# Altium project 定位.PrjPCB
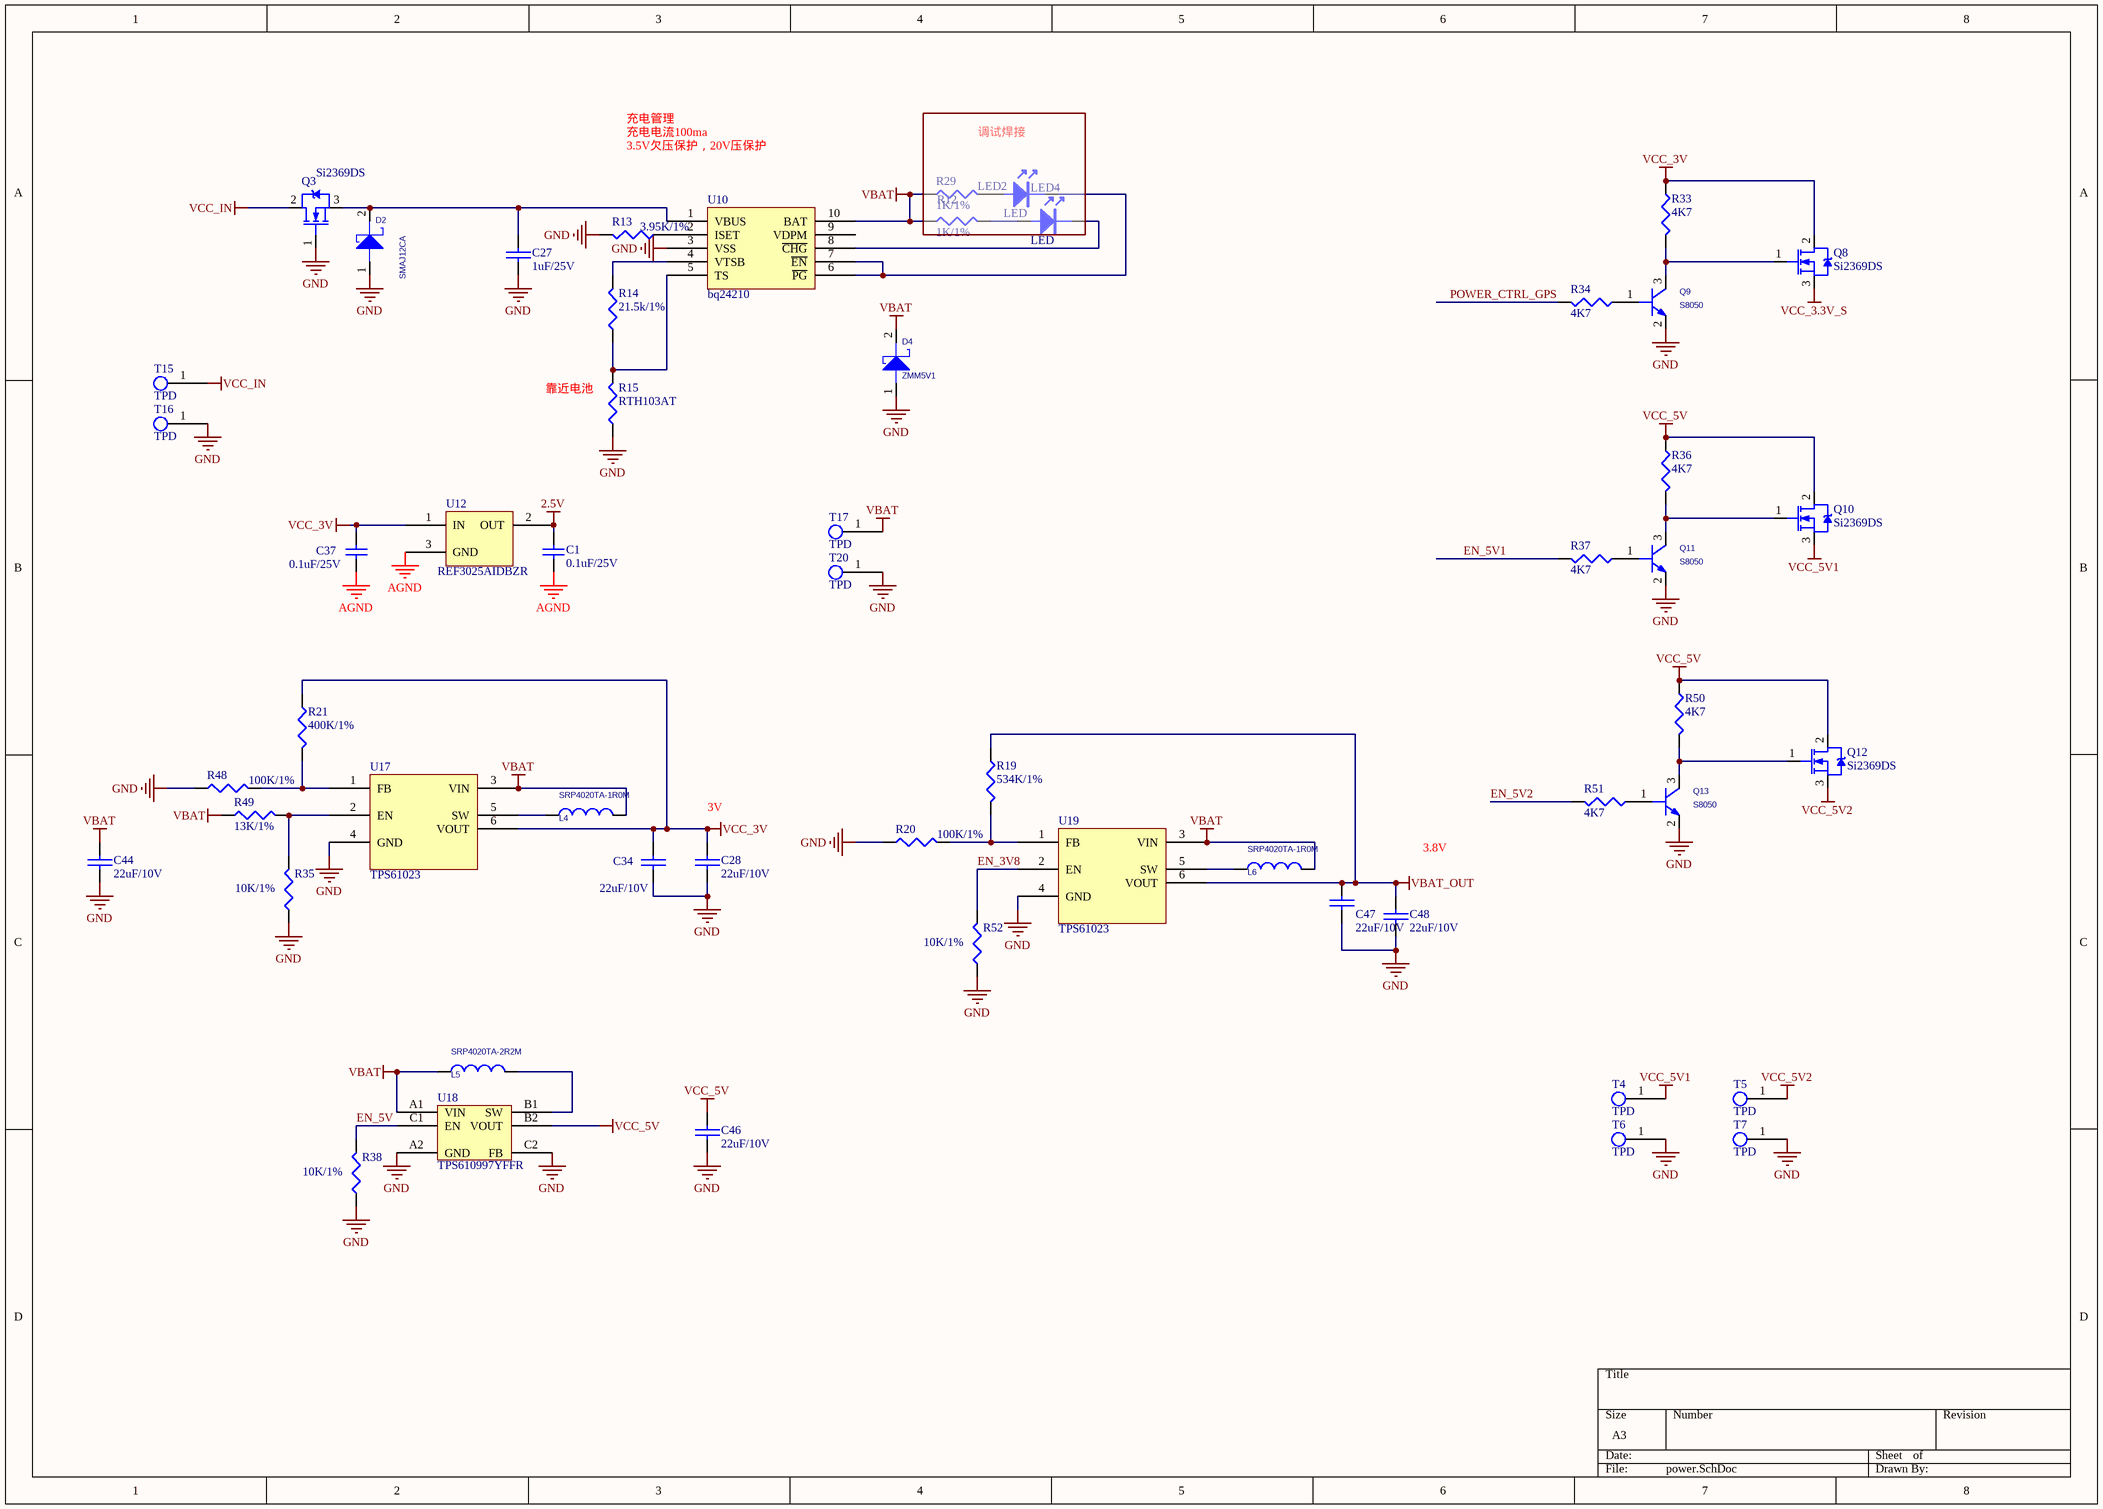
[diagram p0: power.SchDoc]
2 sheets, 100 parts. Net scope: global (net labels, ports and power ports of the same name join across sheets).
Board file: PCB1.2.PcbDoc
Sheets:
  power.SchDoc
  GPS&&lte.SchDoc

## Sheet power.SchDoc
size A3

### Parts
C1  0.1uF/25V  [0402c]
C27  1uF/25V  [0402C]
C28  22uF/10V  [0805C]
C34  22uF/10V  [0805C]
C37  0.1uF/25V  [0402c]
C44  22uF/10V  [0805C]
C46  22uF/10V  [0805C]
C47  22uF/10V  [0805C]
C48  22uF/10V  [0805C]
D2  SMAJ12CA  [SMA]
D4  value ZMM5V1  [LL-34(D1206)]  (hidden comment: DIODE_SCHOTTKY_0)
L4  SRP4020TA-1R0M  [L2520]
L5  SRP4020TA-2R2M  [L2520]
L6  SRP4020TA-1R0M  [L2520]
LED2  LED  [0603LED]
LED4  LED  [0603LED]
Q3  Si2369DS  [sot23-3]
Q8  Si2369DS  [sot23-3]
Q9  S8050  [SOT23-3]
Q10  Si2369DS  [sot23-3]
Q11  S8050  [SOT23-3]
Q12  Si2369DS  [sot23-3]
Q13  S8050  [SOT23-3]
R12  1K/1%  [0402R]
R13  3.95K/1%  [0402R]
R14  21.5k/1%  [0402R]
R15  RTH103AT  [0603R]
R19  534K/1%  [0402R]
R20  100K/1%  [0402R]
R21  400K/1%  [0402R]
R29  1K/1%  [0402R]
R33  4K7  [0402R]
R34  4K7  [0402R]
R35  10K/1%  [0402R]
R36  4K7  [0402R]
R37  4K7  [0402R]
R38  10K/1%  [0402R]
R48  100K/1%  [0402R]
R49  13K/1%  [0402R]
R50  4K7  [0402R]
R51  4K7  [0402R]
R52  10K/1%  [0402R]
T4  TPD  [TP]
T5  TPD  [TP]
T6  TPD  [TP]
T7  TPD  [TP]
T15  TPD  [TP]
T16  TPD  [TP]
T17  TPD  [TP]
T20  TPD  [TP]
U10  bq24210  [QFN50P200X300X80-10N]
U12  REF3025AIDBZR  [SOT23-3]
U17  TPS61023  [SOT563-6]
U18  TPS610997YFFR  [TPS610997YFFR]
U19  TPS61023  [SOT563-6]

### Blocks framed on the sheet
调试焊接: LED2 LED4 R12 R29

### Nets
2.5V: C1.1 U12.2(OUT)
AGND: C1.2 C37.2 U12.3(GND)
GND: C27.2 C28.2 C34.2 C44.2 C46.2 C47.2 C48.2 D2.1 D4.1 Q3.1(G) Q9.2(E) Q11.2(E) Q13.2(E) R13.2 R15.1 R20.1 R35.1 R38.1 R48.1 R52.1 T6.1 T7.1 T16.1 T20.1 U10.3(VSS) U17.4(GND) U18.A2(GND) U18.C2(FB) U19.4(GND)
VBAT: C44.1 D4.2 L4.2 L5.1 L6.2 R12.1 R29.1 R49.1 T17.1 U10.10(BAT) U17.3(VIN) U18.A1(VIN) U19.3(VIN)
VBAT_OUT: C47.1 C48.1 R19.1 U19.6(VOUT)
VCC_3.3V_S: Q8.3(S)
VCC_3V: C28.1 C34.1 C37.1 Q8.2(D) R21.1 R33.1 U12.1(IN) U17.6(VOUT)
VCC_5V: C46.1 Q10.2(D) Q12.2(D) R36.1 R50.1 U18.B2(VOUT)
VCC_5V1: Q10.3(S) T4.1
VCC_5V2: Q12.3(S) T5.1
VCC_IN: Q3.2(D) T15.1
EN_3V8: R52.2 U19.2(EN)
EN_5V: R38.2 U18.C1(EN)
EN_5V1: R37.2
EN_5V2: R51.2
POWER_CTRL_GPS: R34.2
NetC27_1: C27.1 D2.2 Q3.3(S) U10.1(VBUS)
NetL4_1: L4.1 U17.5(SW)
NetL5_2: L5.2 U18.B1(SW)
NetL6_1: L6.1 U19.5(SW)
NetLED2_1: LED2.1 R29.2
NetLED2_2: LED2.2 U10.6(~{PG}) U10.7(~{EN})
NetLED4_1: LED4.1 R12.2
NetLED4_2: LED4.2 U10.8(~{CHG})
NetQ8_1: Q8.1(G) Q9.3(C) R33.2
NetQ9_1: Q9.1(B) R34.1
NetQ10_1: Q10.1(G) Q11.3(C) R36.2
NetQ11_1: Q11.1(B) R37.1
NetQ12_1: Q12.1(G) Q13.3(C) R50.2
NetQ13_1: Q13.1(B) R51.1
NetR13_1: R13.1 U10.2(ISET)
NetR14_1: R14.1 R15.2 U10.5(TS)
NetR14_2: R14.2 U10.4(VTSB)
NetR19_2: R19.2 R20.2 U19.1(FB)
NetR21_2: R21.2 R48.2 U17.1(FB)
NetR35_2: R35.2 R49.2 U17.2(EN)

Not connected (* = marked no-connect by the designer): U10 9(VDPM)

### Notes on the sheet
- 充电管理
- 充电电流100ma
- 3.5V欠压保护，20V压保护
- (near R15) 靠近电池
- (near C28) 3V
- 3.8V

### Library data of the parts
C1 C37 = Cap: Capacitor; Value: 0.1uF; Published: 8-Jun-2000; LatestRevisionDate: 17-Jul-2002; LatestRevisionNote: Re-released for DXP Platform.; PackageReference: RAD-0.3; Publisher: Altium Limited; PackageDescription: Radial Cap, Thru-Hole; 2 Leads; 0.3 in Pin Spacing
C27 C28 C34 C44 C46-C48 = CAP: Capacitor
D2 D4 = DIODE_SCHOTTKY_0: PCB DECAL: DO_214AC; Source_Path: E:\AIH\WORK\A\LIBRARY1.OLB
  D2: Value: SMAJ12CA
L4-L6 = INDUCTOR_1
Q3 Q8 Q10 Q12 = NCE4060K: NMOSFET
Q9 Q11 Q13 = 2N1069_1: PspiceTemplate: Q^@REFDES %C %B %E
R12-R15 R19-R21 R29 R33-R38 R48-R52 = RES1: P: 1/8W
U10 = bq2410
U12 = REF3012

## Sheet GPS&&lte.SchDoc
size A2
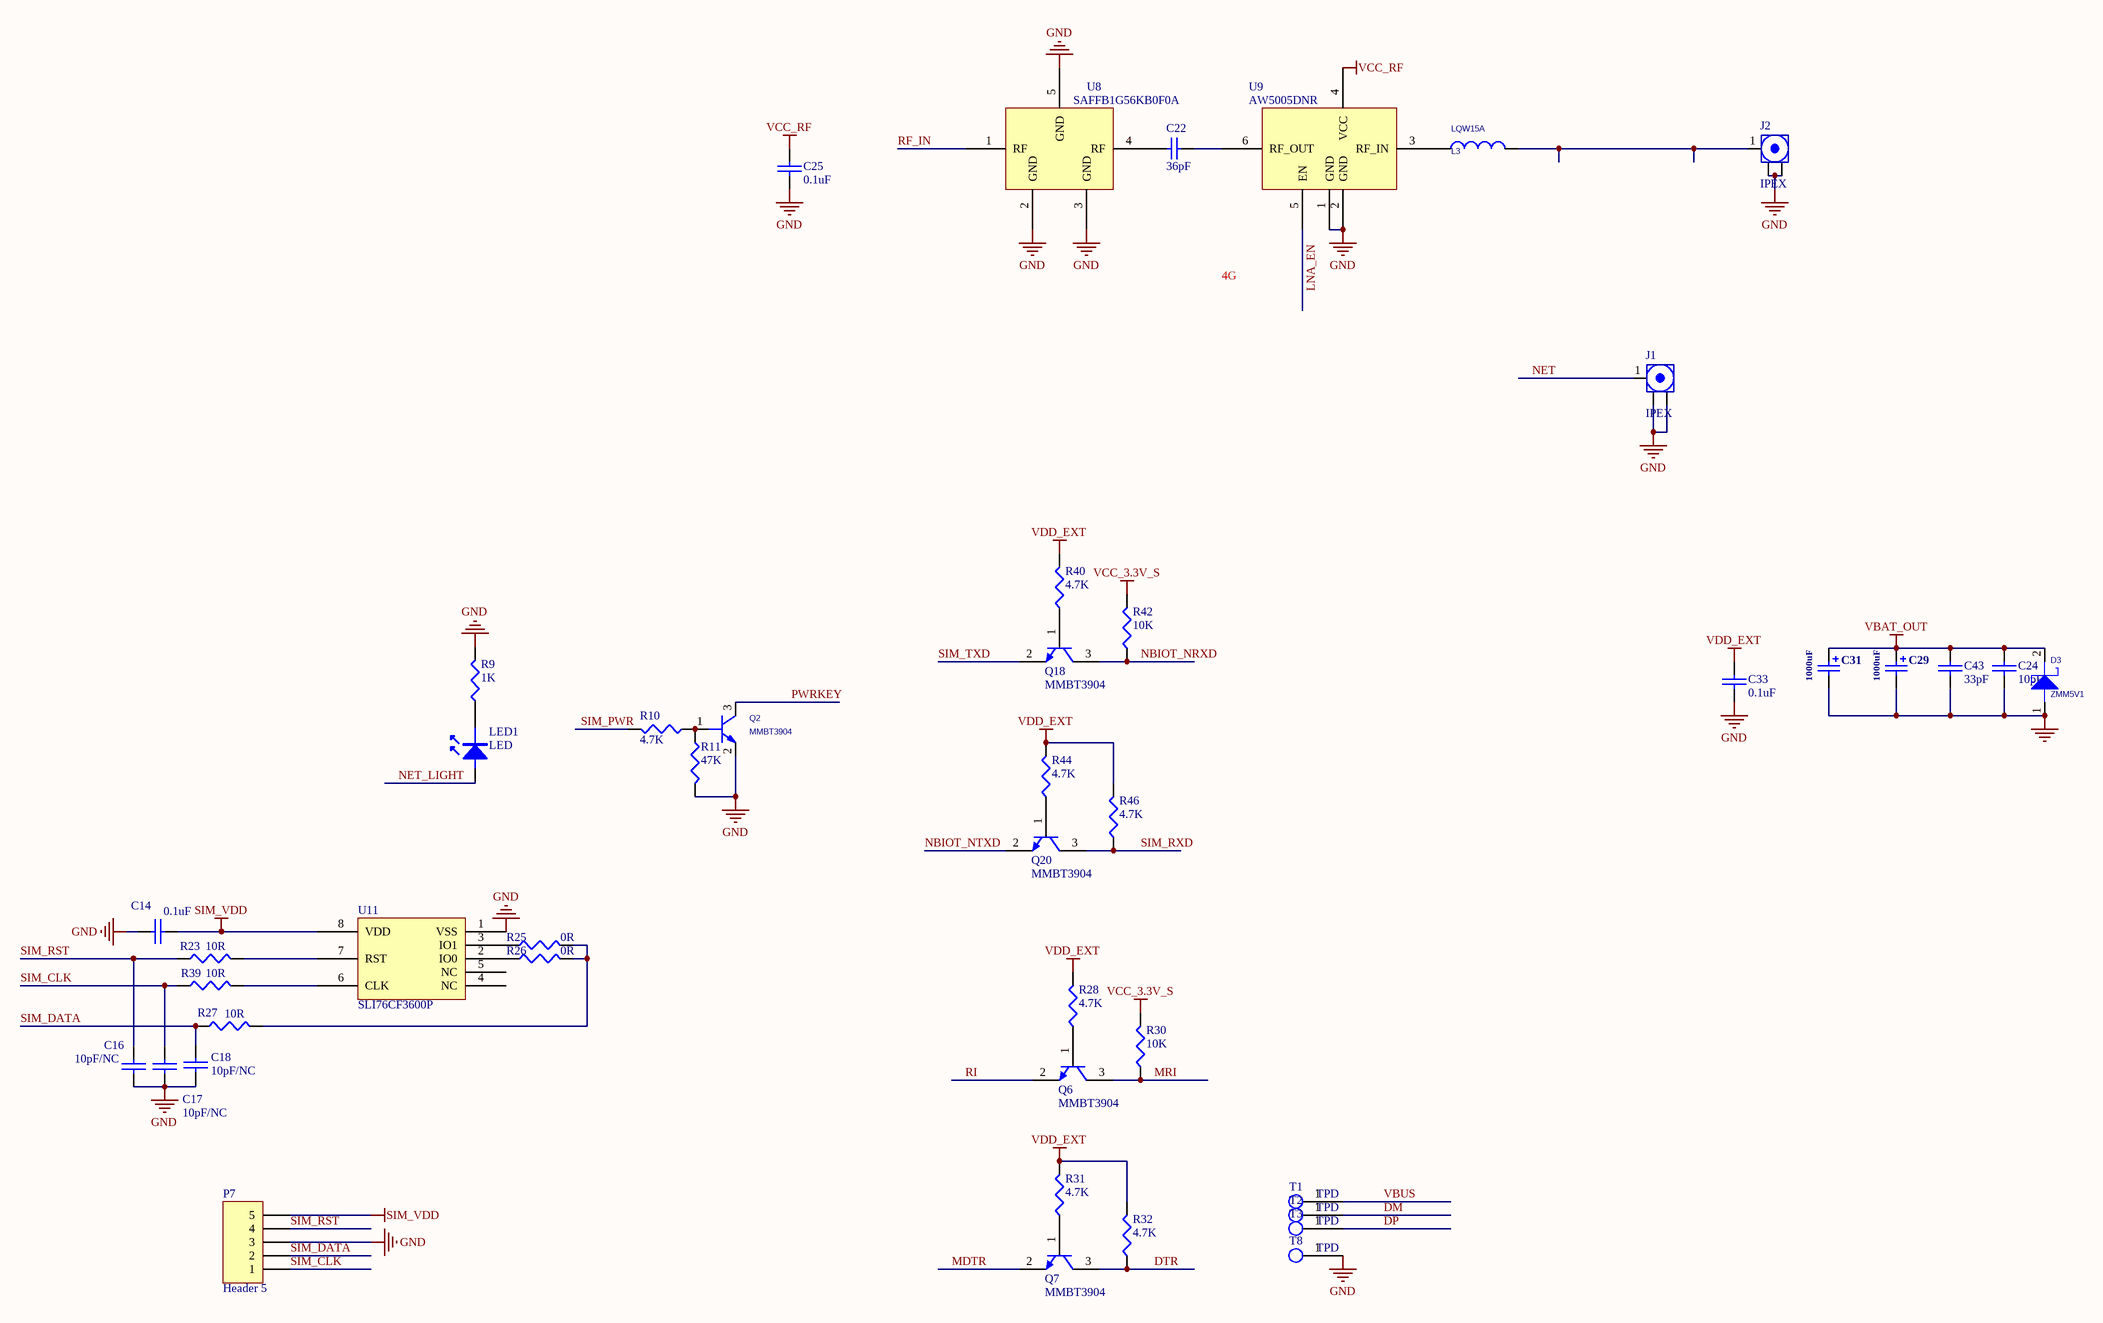
[diagram p1: GPS&&lte.SchDoc]

### Parts
C14  0.1uF  [0402C]
C16  10pF/NC  [0402C]
C17  10pF/NC  [0402C]
C18  10pF/NC  [0402C]
C22  36pF  [0402c]
C24  10pF  [0402C]
C25  0.1uF  [0402C]
C29  1000uF  [7343]
C31  1000uF  [7343]
C33  0.1uF  [0402C]
C43  33pF  [0402C]
D3  value ZMM5V1  [LL-34(D1206)]  (hidden comment: DIODE_SCHOTTKY_0)
J1  IPEX  [RF-UFL]
J2  IPEX  [RF-UFL]
L3  LQW15A  [0402R]
LED1  LED  [0603LED]
P7  Header 5  [5×1.25mmSMT]
Q2  MMBT3904  [SOT23-3]
Q6  MMBT3904  [SOT23-3]
Q7  MMBT3904  [SOT23-3]
Q18  MMBT3904  [SOT23-3]
Q20  MMBT3904  [SOT23-3]
R9  1K  [0402R]
R10  4.7K  [0402R]
R11  47K  [0402R]
R23  10R  [0402R]
R25  0R  [0402R]
R26  0R  [0402R]
R27  10R  [0402R]
R28  4.7K  [0402R]
R30  10K  [0402R]
R31  4.7K  [0402R]
R32  4.7K  [0402R]
R39  10R  [0402R]
R40  4.7K  [0402R]
R42  10K  [0402R]
R44  4.7K  [0402R]
R46  4.7K  [0402R]
T1  TPD  [TPD]
T2  TPD  [TPD]
T3  TPD  [TPD]
T8  TPD  [TPD]
U8  SAFFB1G56KB0F0A  [SAFFB1G56KB0F0A]
U9  AW5005DNR  [AW5005]
U11  SLI76CF3600P  [QFN127P500X600X80-8N]

### Nets
GND: C14.1 C16.1 C17.1 C18.1 C24.1 C25.1 C29.2 C31.2 C33.1 C43.1 D3.1 J1.2(Y) J2.2(Y) P7.3 Q2.2(E) R9.2 R11.2 T8.1 U8.2(GND) U8.3(GND) U8.5(GND) U9.1(GND) U9.2(GND) U11.1(VSS)
SIM_VDD: C14.2 P7.5 U11.8(VDD)
VBAT_OUT: C24.2 C29.1 C31.1 C43.2 D3.2
VCC_3.3V_S: R30.2 R42.2
VCC_RF: C25.2 U9.4(VCC)
VDD_EXT: C33.2 R28.2 R31.2 R32.2 R40.2 R44.2 R46.2
DM: T2.1
DP: T3.1
DTR: Q7.3(C) R32.1
LNA_EN: U9.5(EN)
MDTR: Q7.2(E)
MRI: Q6.3(C) R30.1
NBIOT_NRXD: Q18.3(C) R42.1
NBIOT_NTXD: Q20.2(E)
NET: J1.1(X)
NET_LIGHT: LED1.1
PWRKEY: Q2.3(C)
RF_IN: U8.1(RF)
RI: Q6.2(E)
SIM_CLK: C17.2 P7.1 R39.1
SIM_DATA: C18.2 P7.2 R27.1
SIM_PWR: R10.2
SIM_RST: C16.2 P7.4 R23.1
SIM_RXD: Q20.3(C) R46.1
SIM_TXD: Q18.2(E)
VBUS: T1.1
NetC22_1: C22.1 U8.4(RF)
NetC22_2: C22.2 U9.6(RF_OUT)
NetJ2_1: J2.1(X) L3.2
NetL3_1: L3.1 U9.3(RF_IN)
NetLED1_2: LED1.2 R9.1
NetQ2_1: Q2.1(B) R10.1 R11.1
NetQ6_1: Q6.1(B) R28.1
NetQ7_1: Q7.1(B) R31.1
NetQ18_1: Q18.1(B) R40.1
NetQ20_1: Q20.1(B) R44.1
NetR23_2: R23.2 U11.7(RST)
NetR25_1: R25.1 U11.3(IO1)
NetR25_2: R25.2 R26.2 R27.2
NetR26_1: R26.1 U11.2(IO0)
NetR39_2: R39.2 U11.6(CLK)

Not connected (* = marked no-connect by the designer): U11 4(NC) 5(NC)

### Notes on the sheet
- 4G

### Library data of the parts
C14 C16-C18 C24 C25 C33 C43 = CAP: Capacitor
C22 = Cap: Capacitor; Value: 0.1uF/10V; Published: 8-Jun-2000; LatestRevisionDate: 17-Jul-2002; LatestRevisionNote: Re-released for DXP Platform.; PackageReference: RAD-0.3; Publisher: Altium Limited
C29 C31 = Cap Pol3: Polarized Capacitor (Surface Mount); PackageReference: C10*10.2
D3 = DIODE_SCHOTTKY_0: as D2 on sheet power
J1 J2 = ANT
L3 = INDUCTOR_1
P7 = Header 5: Header, 5-Pin; LatestRevisionDate: 17-Jul-2002; LatestRevisionNote: Re-released for DXP Platform.; Publisher: Altium Limited
Q2 = 2N1069_1: PspiceTemplate: Q^@REFDES %C %B %E
Q6 Q7 Q18 Q20 = NPN
R9-R11 R23 R25-R28 R30-R32 R39 R40 R42 R44 R46 = RES1: P: 1/8W
U8 = SAFFB1G56KBOFA

## Nets that join several sheets
GND: power (29 pins), GPS&&lte (24 pins)
VBAT_OUT: power (C47.1 C48.1 R19.1 U19.6), GPS&&lte (5 pins)
VCC_3.3V_S: power (Q8.3), GPS&&lte (R30.2 R42.2)